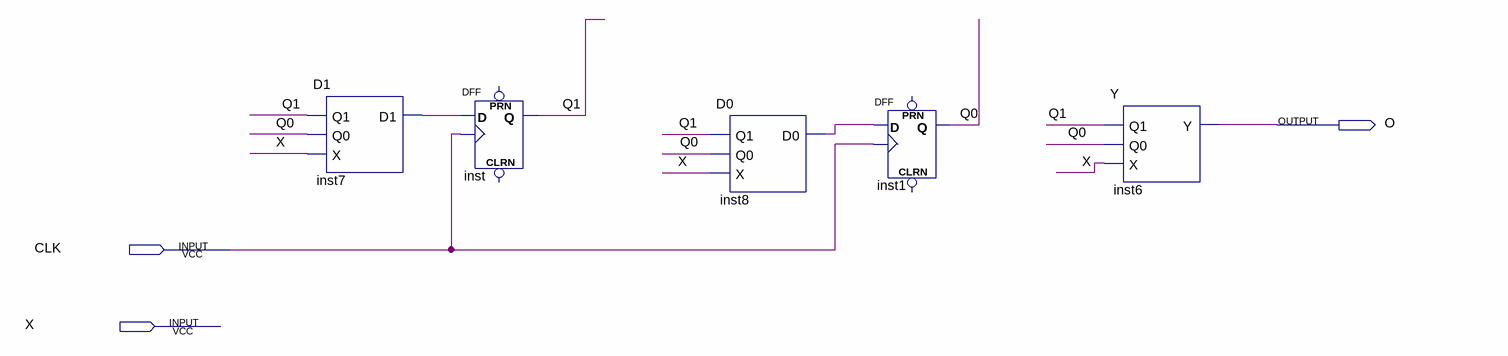
[diagram p0: schematic sheet]
// Quartus schematic Lab02_22521154_Mearly.bdf as structural Verilog: 5 symbols, 3 pins
module Lab02_22521154_Mearly (
  input  CLK,
  input  X,
  output O
);

  wire inst7_d1, inst8_d0, Q0, Q1;

  D1 inst7 (.Q1(Q1), .Q0(Q0), .X(X), .D1(inst7_d1));
  DFF inst (.CLK(CLK), .D(inst7_d1), .Q(Q1));  // open: CLRN, PRN
  D0 inst8 (.Q1(Q1), .Q0(Q0), .X(X), .D0(inst8_d0));
  DFF inst1 (.CLK(CLK), .D(inst8_d0), .Q(Q0));  // open: CLRN, PRN
  Y inst6 (.Q1(Q1), .Q0(Q0), .X(X), .Y(O));
endmodule
